# EAGLE design Camera-Switcher (EAGLE 9.6.0)
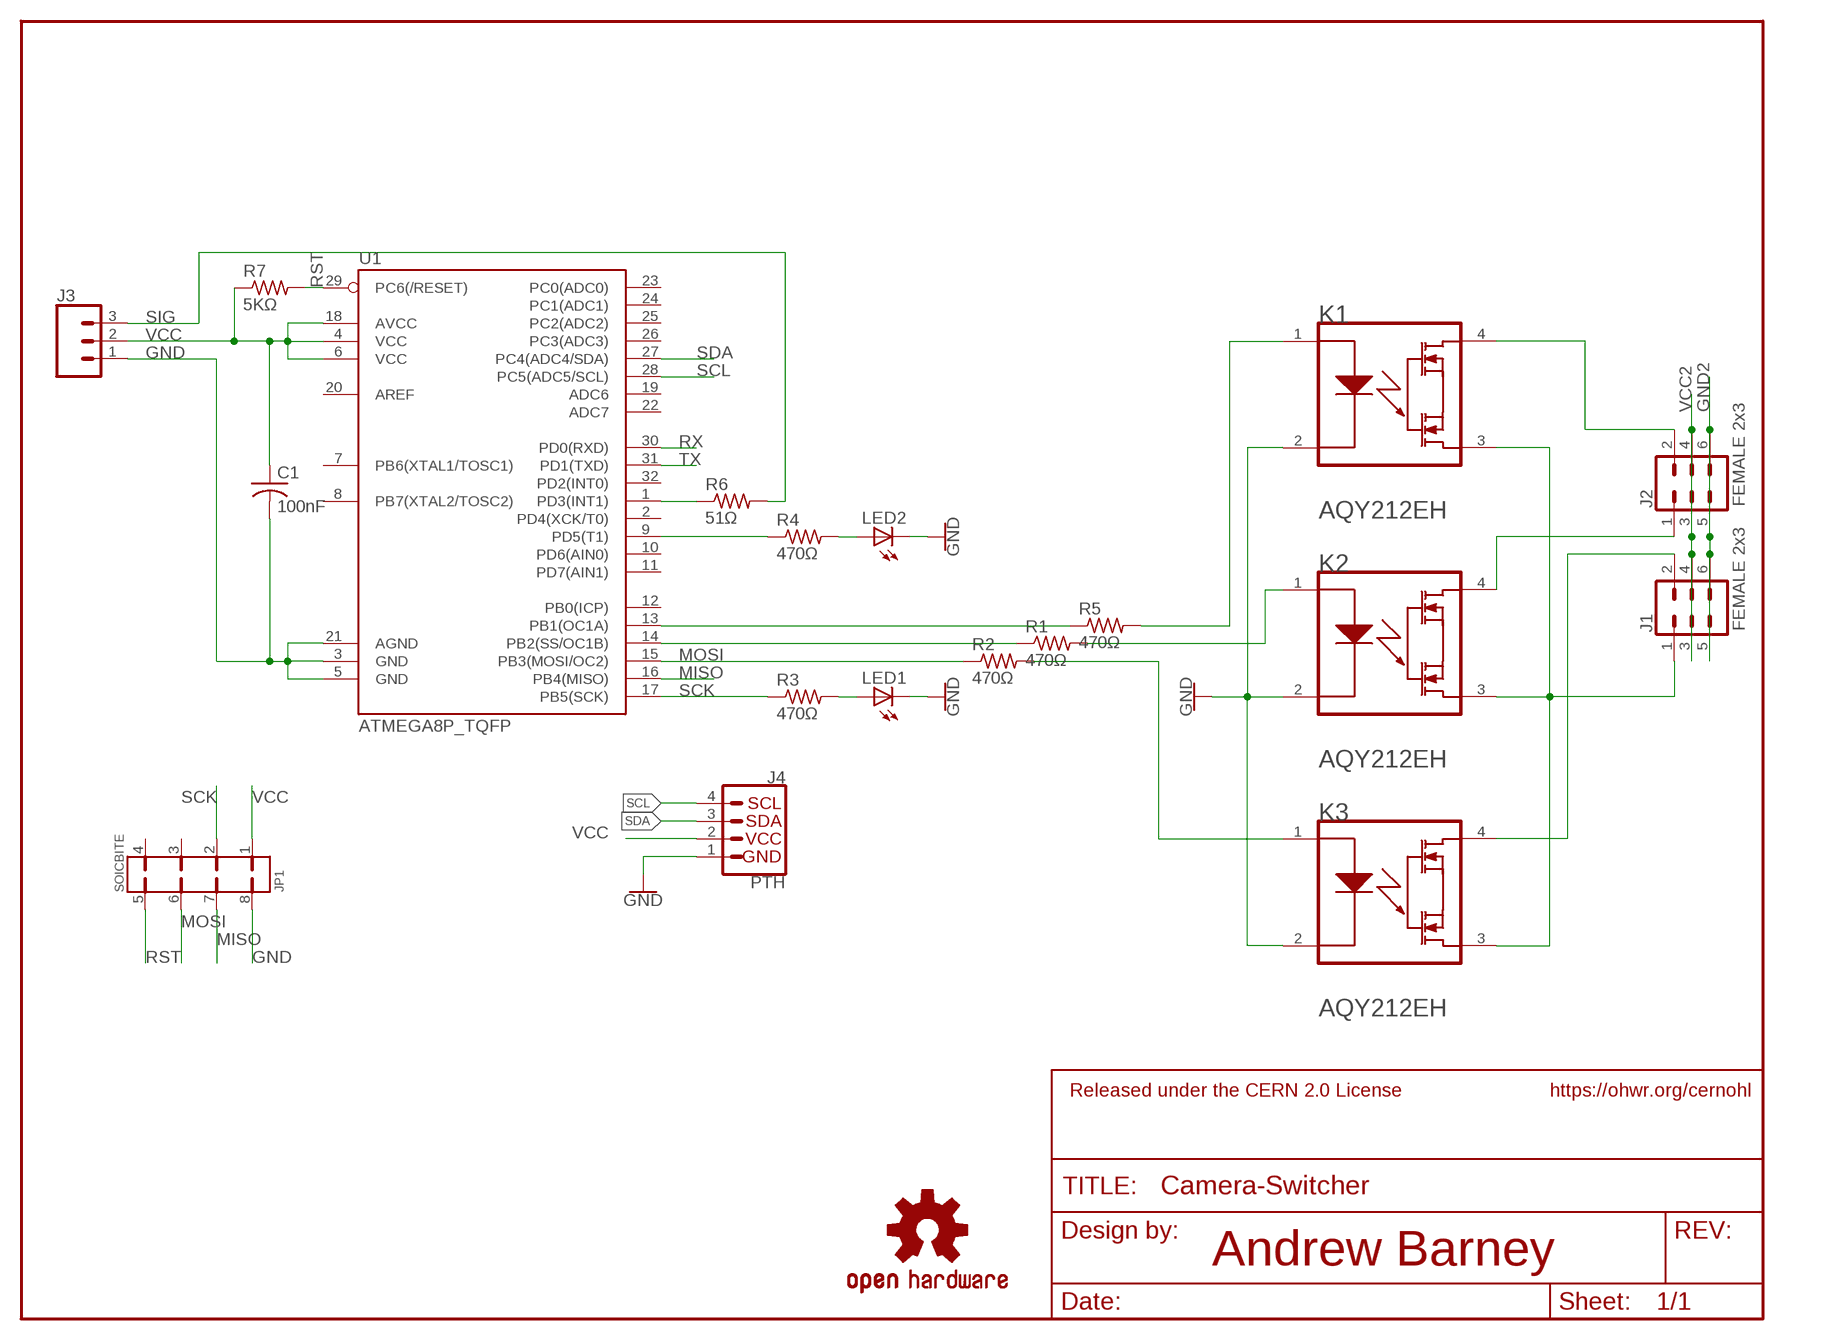
[diagram p0: schematic, sheet 1]

## Parts
C1  100nF  C-USC0805  [C0805]
FRAME1  FRAME-LETTER-CERN"  [CERN-OHL-S]
J1  FEMALE 2x3  CONN_03X2FEMALE  [2X3]
J2  FEMALE 2x3  CONN_03X2FEMALE  [2X3]
J3  CONN_03  [1X03]
J4  PTH  I2C_STANDARD  [1X04]
JP1  SOICBITE  SOICBITE2  [SOICBITE2]
K1  PANASONIC_AQY212EHPANASONIC_AQY212EH_0_0  [PANASONIC_AQY212EH_0]
K2  PANASONIC_AQY212EHPANASONIC_AQY212EH_0_0  [PANASONIC_AQY212EH_0]
K3  PANASONIC_AQY212EHPANASONIC_AQY212EH_0_0  [PANASONIC_AQY212EH_0]
LED1  LEDCHIPLED_0805  [CHIPLED_0805]
LED2  LEDCHIPLED_0805  [CHIPLED_0805]
LOGO1  OSHW-LOGOS  [OSHW-LOGO-S]
R1  470Ω  R-US_R0805  [R0805]
R2  470Ω  R-US_R0805  [R0805]
R3  470Ω  R-US_R0805  [R0805]
R4  470Ω  R-US_R0805  [R0805]
R5  470Ω  R-US_R0805  [R0805]
R6  51Ω  R-US_R0805  [R0805]
R7  5KΩ  R-US_R0805  [R0805]
U1  ATMEGA8P_TQFP  ATMEGA328P_TQFP  [TQFP32-08]

## Nets
GND: C1.2 J3.1 J4.1 JP1.8 K1.2 K2.2 K3.2 LED1.C LED2.C U1.3(GND) U1.5(GND) U1.21(AGND)
GND2: J1.5 J1.6 J2.5 J2.6
MISO: JP1.7 U1.16(PB4(MISO))
MOSI: JP1.6 R2.1 U1.15(PB3(MOSI/OC2))
N$1: R6.1 U1.1(PD3(INT1))
N$2: LED1.A R3.2
N$4: LED2.A R4.2
N$5: R4.1 U1.9(PD5(T1))
N$7: R1.1 U1.14(PB2(SS/OC1B))
N$8: R5.1 U1.13(PB1(OC1A))
N$9: K3.1 R2.2
N$10: K2.1 R1.2
N$11: K1.1 R5.2
N$13: J1.1 K1.3 K2.3 K3.3
N$14: J1.2 K3.4
N$15: J2.1 K2.4
N$16: J2.2 K1.4
RST: JP1.5 R7.2 U1.29(PC6(/RESET))
RX: U1.30(PD0(RXD))
SCK: JP1.2 R3.1 U1.17(PB5(SCK))
SCL: J4.4 U1.28(PC5(ADC5/SCL))
SDA: J4.3 U1.27(PC4(ADC4/SDA))
SIG: J3.3 R6.2
TX: U1.31(PD1(TXD))
VCC: C1.1 J3.2 J4.2 JP1.1 R7.1 U1.4(VCC) U1.6(VCC) U1.18(AVCC)
VCC2: J1.3 J1.4 J2.3 J2.4
Unconnected: JP1.3 JP1.4 U1.2(PD4(XCK/T0)) U1.7(PB6(XTAL1/TOSC1)) U1.8(PB7(XTAL2/TOSC2)) U1.10(PD6(AIN0)) U1.11(PD7(AIN1)) U1.12(PB0(ICP)) U1.19(ADC6) U1.20(AREF) U1.22(ADC7) U1.23(PC0(ADC0)) U1.24(PC1(ADC1)) U1.25(PC2(ADC2)) U1.26(PC3(ADC3)) U1.32(PD2(INT0))

## Notes on the sheet
- Andrew Barney

## Library data of the parts
C1 = adafruit:C-US: CAPACITOR, American symbol
FRAME1 = RMR:FRAME-LETTER-CERN: Schematic Frame - Letter Standard 8.5x11 US Letter frame. CERN 2.0 Licence
J1 J2 = SparkFun-Connectors:CONN_03X2: Multi connection point. Often used as Generic Header-pin footprint for 0.1 inch spaced/style header connections You can populate with any combo of single row headers, but if you'd like an exact match, check these: Header - 2x3 (Male, 0.1") <https://www.sparkfun.com/products/12807> (PRT-12807) Header - 2x3 (Female, 0.1") <https://www.sparkfun.com/products/13010> (PRT-13010) 2x3 Pin Shrouded Header <https://www.sparkfun.com/products/10877> (PRT-10877) On any of the 0.1 inch spaced packages, you can populate with these: Break Away Headers - Straight <https://www.sparkfun.com/products/116> (PRT-00116) Break Away Male Headers - Right Angle <https://www.sparkfun.com/products/553> (PRT-00553) Female Headers <https://www.sparkfun.com/products/115> (PRT-00115) Break Away Headers - Machine Pin <https://www.sparkfun.com/products/117> (PRT-00117) Break Away Female Headers - Swiss Machine Pin <https://www.sparkfun.com/products/743> (PRT-00743) Special note: the shrouded connector mates well with our 3x2 ribbon cables: Ribbon Crimp Connector - 6-pin (2x3, Female) <https://www.sparkfun.com/products/10651> (PRT-10651) Ribbon Cable - 6 wire (15ft) <https://www.sparkfun.com/products/10646> (PRT-10646); PROD_ID: CONN-11566
J3 = SparkFun-Connectors:CONN_03: Multi connection point. Often used as Generic Header-pin footprint for 0.1 inch spaced/style header connections On any of the 0.1 inch spaced packages, you can populate with these: Break Away Headers - Straight <https://www.sparkfun.com/products/116> (PRT-00116) Break Away Male Headers - Right Angle <https://www.sparkfun.com/products/553> (PRT-00553) Female Headers <https://www.sparkfun.com/products/115> (PRT-00115) Break Away Headers - Machine Pin <https://www.sparkfun.com/products/117> (PRT-00117) Break Away Female Headers - Swiss Machine Pin <https://www.sparkfun.com/products/743> (PRT-00743) Stackable Header - 3 Pin (Female, 0.1") <https://www.sparkfun.com/products/13875> (PRT-13875) For SCREWTERMINALS and SPRING TERMINALS visit here: Screw Terimnals on SparkFun.com <https://www.sparkfun.com/search/results?term=Screw+Terminals> (5mm/3.5mm/2.54mm spacing) This device is also useful as a general connection point to wire up your design to another part of your project. Our various solder wires solder well into these plated through hole pads. Hook-Up Wire - Assortment (Stranded, 22 AWG) <https://www.sparkfun.com/products/11375> (PRT-11375) Hook-Up Wire - Assortment (Solid Core, 22 AWG) <https://www.sparkfun.com/products/11367> (PRT-11367) View the entire wire category on our website here <https://www.sparkfun.com/categories/141> Special notes: Molex polarized connector foot print use with SKU : PRT-08232 with associated crimp pins and housings.
J4 = SparkFun-Connectors:I2C_STANDARD: SparkFun I2C Standard Pinout Header SparkFun has standardized on a pinout for all I2C based sensor breakouts. This pinout allows I2C boards to be plugged directly into the headers on Arduino Uno compatible boards, and to be daisy chained easily. Example SparkFun Products: SparkFun Atmospheric Sensor Breakout - BME280 <https://www.sparkfun.com/products/13676> SparkFun Altitude/Pressure Sensor Breakout - MPL3115A2 <https://www.sparkfun.com/products/11084> SparkFun TOF Range Finder Sensor - VL6180 <https://www.sparkfun.com/products/12785>
JP1 = SOICbite_Eagle:SOICBITE: SOICbite footprint Allows for direct clipping of a SOIC-8 Testclip onto a PCB edge for Programming/Debugging purposes without extra components. Original footprint created by: Simon Merrit Adapted to Eagle by: Chiel Voswijk (Foxhood) NOTE: Footprint is to be used on the edge of a PCB and may require the use of thin traces for accessing the inner pads. This may violate some Design Rules! One can often ignore these, but understand working is NOT guaranteed.
K1-K3 = Panasonic - AQY212EH:PANASONIC_AQY212EH: PNSC-AQY212EH-DIP4; CIIVA_IDS: 995471; COMPONENT_LINK_1_DESCRIPTION: Manufacturer URL; COMPONENT_LINK_1_URL: http://www3.panasonic.biz/ac/ae/index.jsp; COMPONENT_LINK_3_DESCRIPTION: Package Specification; COMPONENT_LINK_3_URL: http://www3.panasonic.biz/ac/e_download/control/relay/photomos/catalog/semi_eng_dimensions.pdf?f_cd=401560; CONTINUOUS_LOAD_CURRENT: 0.55 A; DATASHEET: http://www3.panasonic.biz/ac/e_download/control/relay/photomos/catalog/semi_eng_ge1a_aqy21_e.pdf; DATASHEET_VERSION: 201404-T; FOOTPRINT_VARIANT_NAME_0: Manufacturer Recommended; IMPORTED: yes; IMPORTED_FROM: vault; IMPORT_TS: 1521846222; LOAD_VOLTAGE: 60 V; MF: Panasonic; MOUNTING_TECHNOLOGY: Through Hole; MPN: AQY212EH; ON_RESISTANCE_TYP: 0.85 Ohm; PACKAGE: DIP4; PACKAGE_DESCRIPTION: 4-Pin Through Hole Terminal Package, Body 4.78 x 6.4 mm, Pitch 2.54 mm; PACKAGE_VERSION: ASCTB67E, 04/2014; PACKING: Tube; PB__FREE: true; PREFIX: K; RELEASE_DATE: 1421744577; SERIES: PhotoMOS GE 1 Form A; VAULT_GUID: B020AFE5-BB41-4B90-8607-2003BD2CBD59; VAULT_REVISION: C226050E-AE82-494C-BE12-114C3B98AE72
LED1 LED2 = adafruit:LED: LED OSRAM: - CHIPLED LG R971, LG N971, LY N971, LG Q971, LY Q971, LO R971, LY R971 LH N974, LH R974 LS Q976, LO Q976, LY Q976 LO Q996 - Hyper CHIPLED LW Q18S LB Q993, LB Q99A, LB R99A - SideLED LS A670, LO A670, LY A670, LG A670, LP A670 LB A673, LV A673, LT A673, LW A673 LH A674 LY A675 LS A676, LA A676, LO A676, LY A676, LW A676 LS A679, LY A679, LG A679 - Hyper Micro SIDELED® LS Y876, LA Y876, LO Y876, LY Y876 LT Y87S - SmartLED LW L88C, LW L88S LB L89C, LB L89S, LG L890 LS L89K, LO L89K, LY L89K LS L896, LA L896, LO L896, LY L896 - TOPLED LS T670, LO T670, LY T670, LG T670, LP T670 LSG T670, LSP T670, LSY T670, LOP T670, LYG T670 LG T671, LOG T671, LSG T671 LB T673, LV T673, LT T673, LW T673 LH T674 LS T676, LA T676, LO T676, LY T676, LB T676, LH T676, LSB T676, LW T676 LB T67C, LV T67C, LT T67C, LS T67K, LO T67K, LY T67K, LW E67C LS E67B, LA E67B, LO E67B, LY E67B, LB E67C, LV E67C, LT E67C LW T67C LS T679, LY T679, LG T679 LS T770, LO T770, LY T770, LG T770, LP T770 LB T773, LV T773, LT T773, LW T773 LH T774 LS E675, LA E675, LY E675, LS T675 LS T776, LA T776, LO T776, LY T776, LB T776 LHGB T686 LT T68C, LB T68C - Hyper Mini TOPLED® LB M676 - Mini TOPLED Santana® LG M470 LS M47K, LO M47K, LY M47K Source: http://www.osram.convergy.de/
LOGO1 = SparkFun-Aesthetics:OSHW-LOGO: Open-Source Hardware (OSHW) Logo This logo indicates the piece of hardware it is found on incorporates a OSHW license and/or adheres to the definition of open source hardware found here: http://freedomdefined.org/OSHW
R1-R7 = adafruit:R-US_: RESISTOR, American symbol
U1 = SparkFun-IC-Microcontroller:ATMEGA328P_TQFP: Popular 328P in QFP Storefront component: ATmega328 - TQFP <https://www.sparkfun.com/products/13448> (COM-13448) Datasheet <http://www.sparkfun.com/datasheets/Components/SMD/ATMega328.pdf> SparkFun Products SparkFun RedBoard - Programmed with Arduino <https://www.sparkfun.com/products/12757> (DEV-12757) Arduino Pro Mini 328 - 5V/16MHz <https://www.sparkfun.com/products/11113> (DEV-11113) Arduino Pro Mini 328 - 3.3V/8MHz <https://www.sparkfun.com/products/11114> (DEV-11114) SparkFun OpenLog <https://www.sparkfun.com/products/13712> (DEV-13712) SparkFun MicroView - OLED Arduino Module <https://www.sparkfun.com/products/12923> (DEV-12923) SparkFun Digital Sandbox <https://www.sparkfun.com/products/12651> (DEV-12651) SparkFun PicoBoard <https://www.sparkfun.com/products/11888> (WIG-11888) Arduino Fio <https://www.sparkfun.com/products/10116> (DEV-10116) LilyPad Arduino 328 Main Board <https://www.sparkfun.com/products/13342> (DEV-13342) SparkFun RedStick <https://www.sparkfun.com/products/13741> (DEV-13741) LilyPad MP3 <https://www.sparkfun.com/products/11013> (DEV-11013) LilyPad Arduino SimpleSnap <https://www.sparkfun.com/products/10941> (DEV-10941) SparkFun Stepoko <https://www.sparkfun.com/products/13899> (ROB-13899) SparkFun Geiger Counter <https://www.sparkfun.com/products/11345> (SEN-11345) SparkFun EL Sequencer <https://www.sparkfun.com/products/12781> (COM-12781) Arduino Pro 328 - 5V/16MHz <https://www.sparkfun.com/products/10915> (DEV-10915) CryptoCape <https://www.sparkfun.com/products/12773> (DEV-12773) SparkFun IR Thermometer Evaluation Board - MLX90614 <https://www.sparkfun.com/products/10740> (SEN-10740) SparkFun RedBot Mainboard <https://www.sparkfun.com/products/12097> (ROB-12097) Arduino Pro 328 - 3.3V/8MHz <https://www.sparkfun.com/products/10914> (DEV-10914) SparkFun Block for Intel® Edison - Arduino <https://www.sparkfun.com/products/13036> (DEV-13036) SparkFun Simon Says - Surface Mount Soldering Kit <https://www.sparkfun.com/products/10935> (KIT-10935) SparkFun 7-Segment Serial Display - Red <https://www.sparkfun.com/products/11441> (COM-11441) SparkFun 7-Segment Serial Display - White <https://www.sparkfun.com/products/11629> (COM-11629) SparkFun 7-Segment Serial Display - Yellow <https://www.sparkfun.com/products/11443> (COM-11443) SparkFun 7-Segment Serial Display - Kelly Green <https://www.sparkfun.com/products/11440> (COM-11440) SparkFun 7-Segment Serial Display - Blue <https://www.sparkfun.com/products/11442> (COM-11442) SparkFun OpenSegment Serial Display - 20mm (Blue) <https://www.sparkfun.com/products/11647> (COM-11647) SparkFun OpenSegment Serial Display - 20mm (Green) <https://www.sparkfun.com/products/11646> (COM-11646) SparkFun OpenSegment Serial Display - 20mm (White) <https://www.sparkfun.com/products/11648> (COM-11648) SparkFun OpenSegment Serial Display - 20mm (Red) <https://www.sparkfun.com/products/11644> (COM-11644) SparkFun OpenSegment Serial Display - 20mm (Yellow) <https://www.sparkfun.com/products/11645> (COM-11645) SparkFun OpenSegment Shield <https://www.sparkfun.com/products/13190> (DEV-13190); PROD_ID: IC-09069; VALUE: ATMEGA328P_TQFP

## Board
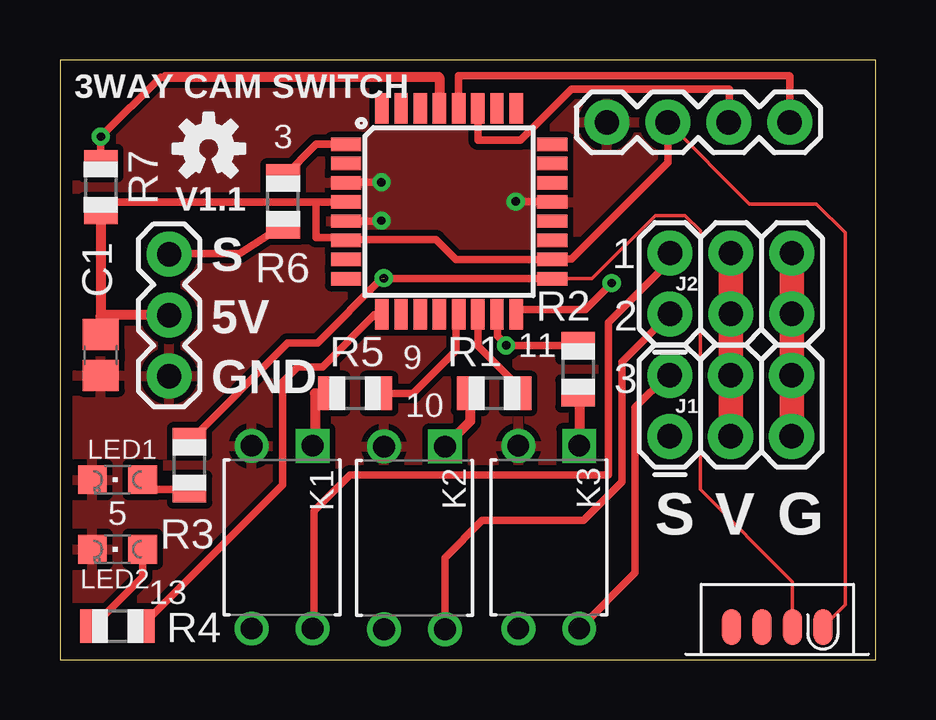
[diagram p1: board, top side]
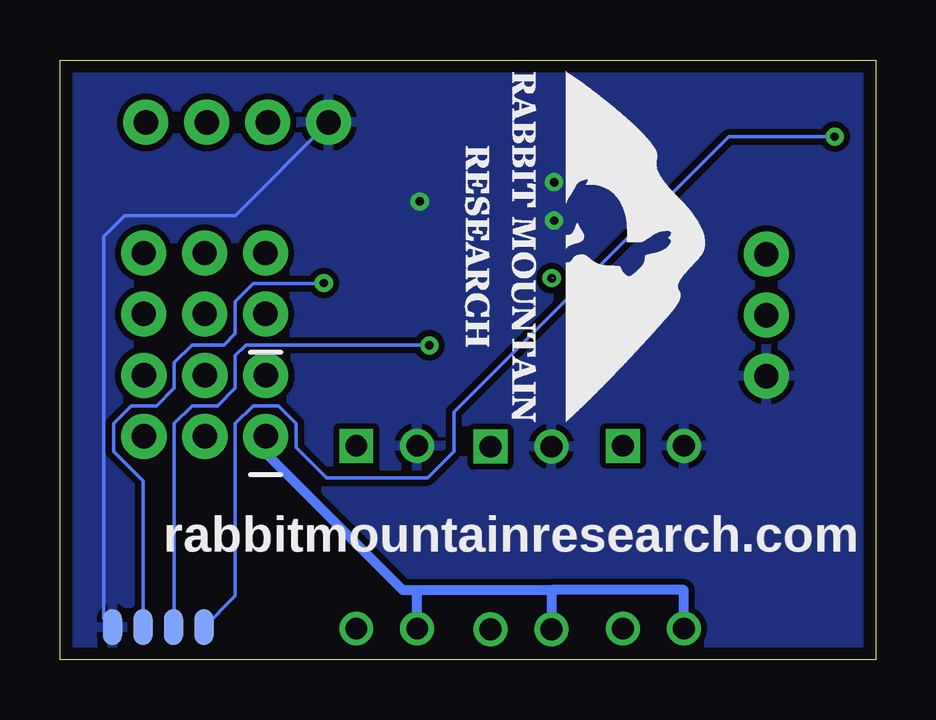
[diagram p2: board, bottom side, seen from below]

Size 34 x 25 mm. Coordinates in mm from the lower left corner, seen from the top.
Outline: 0,0 34,0 34,25 0,25 0,0
Copper layers (1*16): Top 0.035mm / dielectric 1.5mm / Bottom 0.035mm
Design rules "default *": minimum track width 6mil, minimum drill 0.35mm, track to track 10mil, track to pad 10mil, pad to pad 10mil, via to via 10mil, smd to smd 6mil, copper to edge 20mil, drill to drill 6mil, minimum pad ring 10mil, minimum via ring 8mil, stop-mask expansion 4mil, vias tented up to drill 0mil, thermal gap 10mil

### Footprints (pad centres in the part's own frame; a part is rotated, then mirrored left to right if it is on the bottom)
C0805 = smd 1.3 x 1.5: 1 -0.85,0; 2 0.85,0
2X3 = drill 1.016 pad 1.88: 1 0,0; 2 0,2.54; 3 2.54,0; 4 2.54,2.54; 5 5.08,0; 6 5.08,2.54
1X03 = drill 1.016 pad 1.88: 1 0,0; 2 2.54,0; 3 5.08,0
1X04 = drill 1.016 pad 1.88: 1 0,0; 2 2.54,0; 3 5.08,0; 4 7.62,0
SOICBITE2 = smd 0.8 x 1.5: 1 1.905,0.75; 2 0.635,0.75; 3 -0.635,0.75; 4 -1.905,0.75 | smd 0.8 x 1.5 bottom: 5 -1.905,0.75; 6 -0.635,0.75; 7 0.635,0.75; 8 1.905,0.75
PANASONIC_AQY212EH_0 = drill 0.9 pad 1.4 square: 1 0,0 | drill 0.9 pad 1.4: 2 0,-2.54; 3 7.62,-2.54; 4 7.62,0
CHIPLED_0805 = smd 1.2 x 1.2: A 0,-1.05; C 0,1.05
R0805 = smd 1.1 x 1.4: 1 -1,0; 2 1,0
TQFP32-08 = smd 1.27 x 0.559: 1 -4.293,2.8; 2 -4.293,2; 3 -4.293,1.2; 4 -4.293,0.4; 5 -4.293,-0.4; 6 -4.293,-1.2; 7 -4.293,-2; 8 -4.293,-2.8; 17 4.293,-2.8; 18 4.293,-2; 19 4.293,-1.2; 20 4.293,-0.4; 21 4.293,0.4; 22 4.293,1.2; 23 4.293,2; 24 4.293,2.8 | smd 0.559 x 1.27: 9 -2.8,-4.293; 10 -2,-4.293; 11 -1.2,-4.293; 12 -0.4,-4.293; 13 0.4,-4.293; 14 1.2,-4.293; 15 2,-4.293; 16 2.8,-4.293; 25 2.8,4.293; 26 2,4.293; 27 1.2,4.293; 28 0.4,4.293; 29 -0.4,4.293; 30 -1.2,4.293; 31 -2,4.293; 32 -2.8,4.293

### Placement (x,y rotation side)
C1  1.7,12.7 270 top
FRAME1  6.3,-10.8 0 top  (outside the outline)
J1  25.42,9.31 0 top
J2  25.43,14.41 0 top
J3  4.55,11.82 90 top
J4  22.8,22.4 0 top
JP1  29.9,0.6 0 top
K1  10.53,8.91 270 top
K2  16.05,8.88 270 top
K3  21.65,8.91 270 top
LED1  2.4,7.5 90 top
LED2  2.4,4.6 90 top
LOGO1  6.2,21.3 0 top
R1  18.1,11.1 180 top
R2  21.6,12.1 270 top
R3  5.4,8.1 270 top
R4  2.4,1.4 180 top
R5  12.3,11.1 180 top
R6  9.3,19.1 270 top
R7  1.7,19.7 90 top
U1  16.22,18.68 0 top
U$1  [RMR-SIT-10MM]  17.1,24.5 270 bottom

### Tracks (layer width: path | path; a pad name or v marks a point on that pad's centre or on a via)
GND  (via drill 0.35)
  Top 0.152: U1.21 20.52,19.07
  Top 0.254: 1.45,11.6 C1.2
  Top 0.305: U1.21 20.49,19.1 v19,19.1 | U1.3 11.93,19.9 v13.4,19.9 | U1.5 13.4,18.28 v13.4,18.3
  Top 0.406: LED1.C 1.1,7.5
  Bottom 0.152: JP1.8 32.18,1.72 32.18,17.64 31.3,18.52 26.68,18.52 J4.1
  pour Bottom: -0.3,25.3 34.4,25.3 34.4,-0.6 -0.3,-0.6
  pour Top: -0.9,26.1 35.3,26.1 35.3,-1.2 -0.9,-1.2
GND2
  Top 1.016: J2.6 J2.5 J1.6 J1.5
MISO  (via drill 0.35)
  Top 0.305: U1.16 19.23,14.6 21.9,14.6 v23,15.7
  Bottom 0.152: v23,15.7 23.02,15.68 25.96,15.68 26.7,14.94 26.7,13.58 27.16,13.12 28.49,13.12 29.23,12.38 29.23,11.32 29.97,10.58 31.03,10.58 31.77,9.84 31.77,8.68 30.54,7.45 JP1.7
MOSI  (via drill 0.35)
  Top 0.305: U1.15 18.23,14.37 18.23,13.48 18.6,13.12 v18.6,13.1 R2.1
  Bottom 0.152: JP1.6 29.23,1.39 29.23,9.84 28.49,10.58 27.43,10.58 26.69,11.32 26.69,12.68 26.25,13.12 18.62,13.12 v18.6,13.1
N$1
  Top 0.305: R6.1 10.68,21.48 U1.1
N$2
  Top 0.254: 5,7.5 R3.2
  Top 0.305: R3.2 3.85,7.1 LED1.A
N$4
  Top 0.305: R4.2 3.45,3.45 LED2.A
N$5
  Top 0.305: R4.1 9.28,7.29 9.28,11.57 9.92,12.21 10.94,12.21 13.12,14.39 U1.9
N$7
  Top 0.305: U1.14 17.42,13.08 19.1,11.4 R1.1
N$8
  Top 0.305: U1.13 16.51,14.27 16.51,12.88 14.72,11.1 R5.1
N$9
  Top 0.406: R2.2 21.65,11.05 K3.1
N$10
  Top 0.406: 16.09,8.92 K2.1 17.1,9.93 R1.2
N$11
  Top 0.406: R5.2 10.63,11.1 10.63,9.01 K1.1
N$13
  Bottom 0.406: K1.3 7.99,2.9 13.51,2.9 | 13.51,2.9 K2.3 | K3.3 19.11,2.9 | 19.11,2.9 19.71,2.9 25.42,8.61 J1.1 | 19.11,2.9 13.51,2.9
N$14
  Top 0.305: J1.2 25.32,11.85 23.98,10.51 23.98,3.62 K3.4
N$15
  Top 0.305: J2.1 23.42,12.4 23.42,7.41 21.81,5.8 17.6,5.8 16.05,4.25 K2.4
N$16
  Top 0.305: J2.2 25.43,16.61 22.86,14.04 22.86,7.7 12.1,7.7 10.6,6.2 10.6,1.36 K1.4
RST  (via drill 0.35)
  Top 0.305: 4.39,24.29 4.19,24.29 v1.7,21.8 R7.2
  Top 0.406: 4.39,24.29 15.8,24.29 15.82,24.27 U1.29
  Bottom 0.152: JP1.5 26.69,2.65 26.69,9.84 25.95,10.58 24.89,10.58 24.15,9.84 24.15,8.84 22.89,7.58 18.68,7.58 17.58,8.68 17.58,10.33 6.11,21.8 v1.7,21.8
SCK  (via drill 0.35)  (1 unrouted)
  Top 0.152: JP1.2 30.54,3.24 26.69,7.08 26.69,13.87 26.7,13.88 26.7,17.88 26.06,18.52 24.82,18.52 22.18,15.88 U1.17
  Top 0.305: R3.1 9.49,13.19 10.73,13.19 13.42,15.88 | U1.17 13.52,15.88 v13.5,15.9
SCL
  Top 0.152: 16.6,22.99 U1.28
  Top 0.305: U1.28 16.62,24.34 30.4,24.34 30.42,24.32 J4.4
SDA
  Top 0.152: 17.61,23.16 U1.27 17.4,22.99
  Top 0.305: U1.27 17.42,21.65 19.19,21.65 21.32,23.78 27.9,23.78 27.9,22.42 J4.3
SIG
  Top 0.305: R6.2 7.48,16.92 4.57,16.92 J3.3
VCC
  Top 0.152: 20.52,16.67 U1.18 | JP1.1 32.74,2.29 32.74,17.8 31.54,19 28.74,19 J4.2
  Top 0.254: 1.7,19.08 R7.1
  Top 0.305: U1.4 10.69,19.08 | 10.69,19.08 10.69,17.59 11.93,17.59 11.93,17.52 | 11.93,17.52 U1.6 | U1.18 16.52,16.68 15.69,17.52 11.93,17.52 | 10.69,19.08 1.7,19.08 | 20.52,16.67 20.55,16.69 21.32,16.69 25.34,20.72 J4.2
  Top 0.406: J3.2 1.7,14.36 | R7.1 1.7,14.36 | C1.1 1.7,14.36
VCC2
  Top 1.016: J1.3 J1.4 J2.3 J2.4

### Text on the board
tPlace: 3WAY CAM SWITCH | 3 | V1.1 | S | 1 | 5V | 2 | 11 | 9 | GND | 3 | 10 | 5 | S | V | G | 13
bPlace: rabbitmountainresearch.com